# Altium schematic sheet main.SchDoc
size A; SheetNumber: 0; SheetTotal: 6
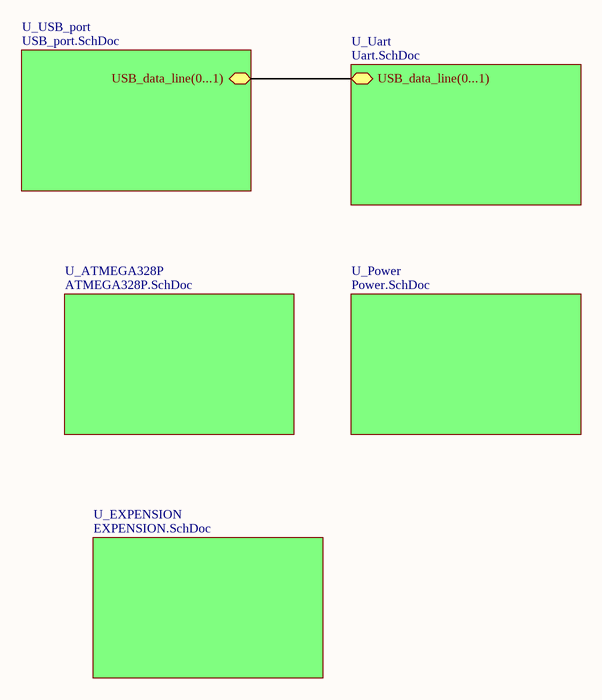
[diagram p0: main.SchDoc]

## Sub-sheets
U_ATMEGA328P = ATMEGA328P.SchDoc: no entries
U_EXPENSION = EXPENSION.SchDoc: no entries
U_Power = Power.SchDoc: no entries
U_Uart = Uart.SchDoc: USB_data_line(0...1) (bidir)
U_USB_port = USB_port.SchDoc: USB_data_line(0...1) (bidir)